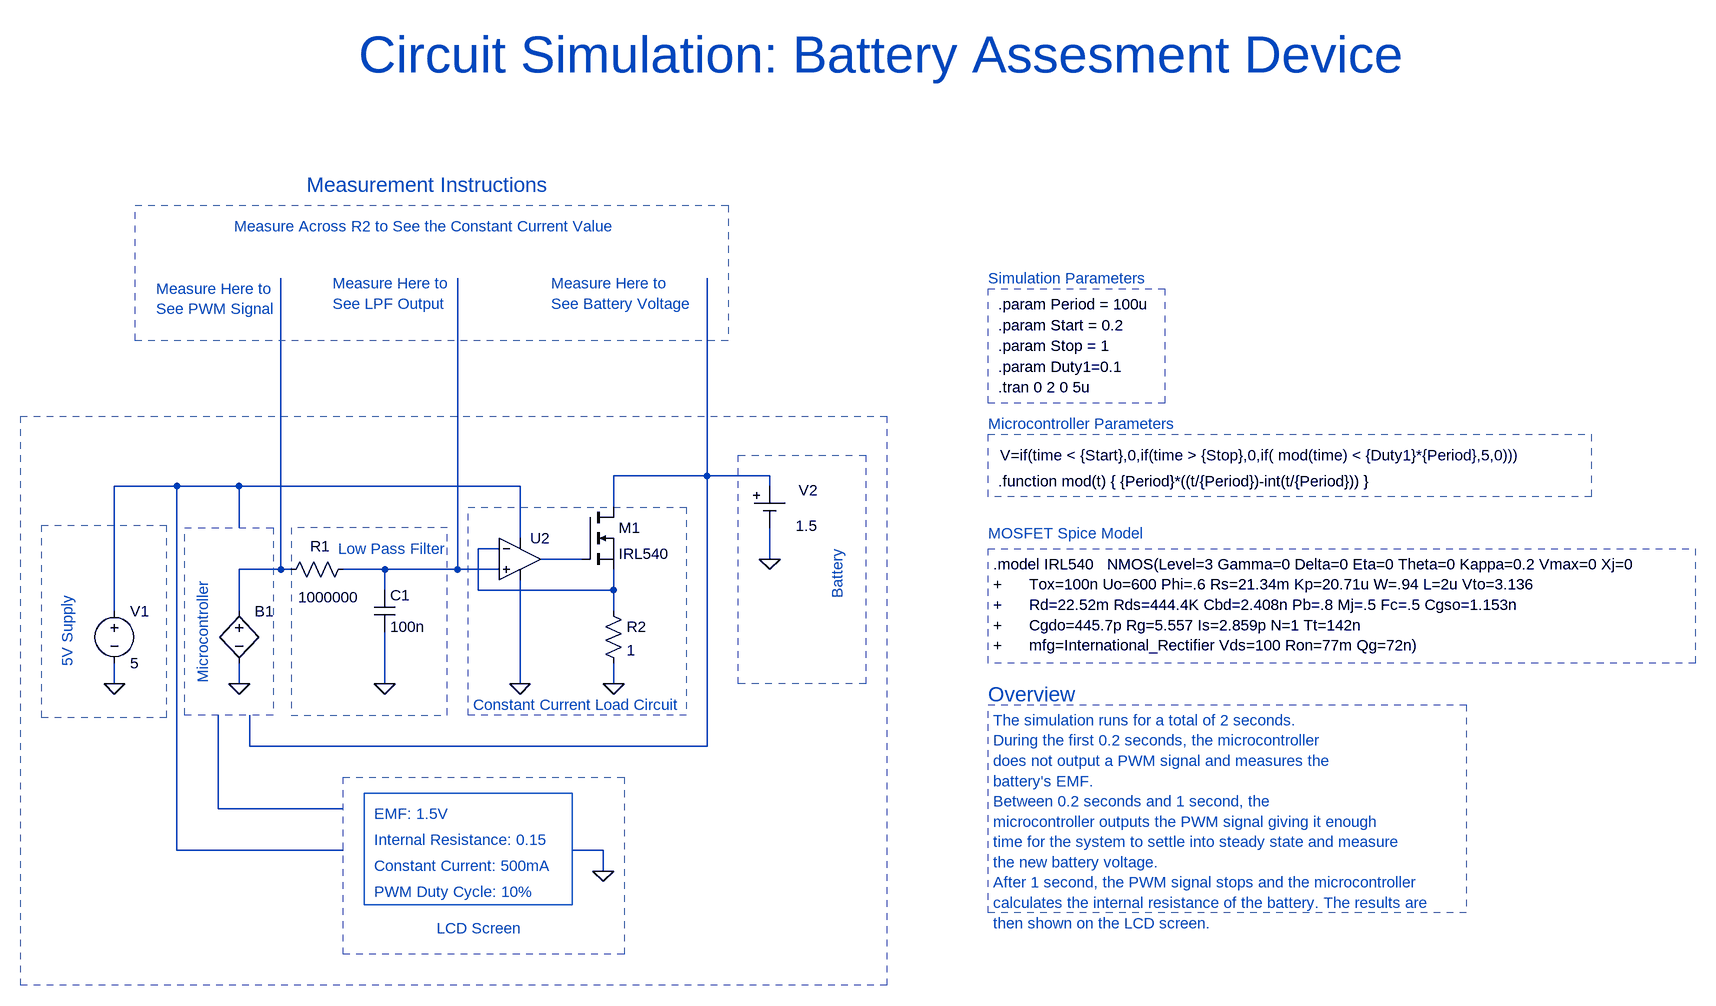
[diagram p0: schematic Design Simulation.asc]
Design Simulation.asc, the LTspice schematic file:
Version 4
SHEET 1 2728 1588
WIRE -176 448 -176 144
WIRE -176 448 -320 448
WIRE -80 448 -176 448
WIRE -992 464 -1088 464
WIRE -896 464 -992 464
WIRE -464 464 -896 464
WIRE -80 464 -80 448
WIRE -320 496 -320 448
WIRE -896 528 -896 464
WIRE -464 544 -464 464
WIRE -496 560 -528 560
WIRE -368 576 -432 576
WIRE -80 576 -80 528
WIRE -832 592 -832 144
WIRE -832 592 -896 592
WIRE -816 592 -832 592
WIRE -672 592 -736 592
WIRE -560 592 -560 144
WIRE -560 592 -672 592
WIRE -496 592 -560 592
WIRE -672 624 -672 592
WIRE -528 624 -528 560
WIRE -320 624 -320 592
WIRE -320 624 -528 624
WIRE -1088 656 -1088 464
WIRE -896 656 -896 592
WIRE -320 656 -320 624
WIRE -1088 768 -1088 736
WIRE -896 768 -896 736
WIRE -672 768 -672 688
WIRE -464 768 -464 608
WIRE -320 768 -320 736
WIRE -880 864 -880 816
WIRE -176 864 -176 448
WIRE -176 864 -880 864
WIRE -928 960 -928 816
WIRE -736 960 -928 960
WIRE -992 1024 -992 464
WIRE -736 1024 -992 1024
WIRE -336 1024 -384 1024
WIRE -336 1056 -336 1024
FLAG -672 768 0
FLAG -896 768 0
FLAG -320 768 0
FLAG -80 576 0
FLAG -464 768 0
FLAG -1088 768 0
FLAG -336 1056 0
SYMBOL res -720 576 R90
WINDOW 0 -4 51 VBottom 2
WINDOW 3 43 38 VTop 2
SYMATTR InstName R1
SYMATTR Value 1000000
SYMBOL cap -688 624 R0
SYMATTR InstName C1
SYMATTR Value 100n
SYMBOL bv -896 640 R0
WINDOW 3 1171 -224 Left 2
SYMATTR Value V=if(time < {Start},0,if(time > {Stop},0,if( mod(time) < {Duty1}*{Period},5,0)))
SYMATTR InstName B1
SYMBOL voltage -1088 640 R0
SYMATTR InstName V1
SYMATTR Value 5
SYMBOL nmos -368 496 R0
SYMATTR InstName M1
SYMATTR Value IRL540
SYMBOL res -336 640 R0
SYMATTR InstName R2
SYMATTR Value 1
SYMBOL Misc/cell -80 464 R0
WINDOW 3 40 61 Left 2
WINDOW 0 45 6 Left 2
SYMATTR Value 1.5
SYMATTR InstName V2
SYMATTR SpiceLine Rser=0.15
SYMBOL Opamps/UniversalOpamp2 -464 576 R0
SYMATTR InstName U2
TEXT 264 584 Left 2 !.model IRL540   NMOS(Level=3 Gamma=0 Delta=0 Eta=0 Theta=0 Kappa=0.2 Vmax=0 Xj=0\n+      Tox=100n Uo=600 Phi=.6 Rs=21.34m Kp=20.71u W=.94 L=2u Vto=3.136\n+      Rd=22.52m Rds=444.4K Cbd=2.408n Pb=.8 Mj=.5 Fc=.5 Cgso=1.153n\n+      Cgdo=445.7p Rg=5.557 Is=2.859p N=1 Tt=142n\n+      mfg=International_Rectifier Vds=100 Ron=77m Qg=72n)
TEXT 272 312 Left 2 !.tran 0 2 0 5u
TEXT 272 456 Left 2 !.function mod(t) { {Period}*((t/{Period})-int(t/{Period})) }
TEXT 272 184 Left 2 !.param Period = 100u
TEXT 272 280 Left 2 !.param Duty1=0.1
TEXT 272 216 Left 2 !.param Start = 0.2
TEXT 256 368 Left 2 ;Microcontroller Parameters
TEXT -952 608 VRight 2 ;Microcontroller
TEXT -744 560 Left 2 ;Low Pass Filter
TEXT 256 144 Left 2 ;Simulation Parameters
TEXT -536 800 Left 2 ;Constant Current Load Circuit
TEXT 256 536 Left 2 ;MOSFET Spice Model
TEXT -1160 632 VRight 2 ;5V Supply
TEXT -688 968 Left 2 ;EMF: 1.5V
TEXT -688 1008 Left 2 ;Internal Resistance: 0.15
TEXT -688 1048 Left 2 ;Constant Current: 500mA
TEXT -688 1088 Left 2 ;PWM Duty Cycle: 10%
TEXT -592 1144 Left 2 ;LCD Screen
TEXT 24 560 VRight 2 ;Battery
TEXT -1024 160 Left 2 ;Measure Here to\nSee PWM Signal
TEXT -752 152 Left 2 ;Measure Here to\nSee LPF Output
TEXT -416 152 Left 2 ;Measure Here to\nSee Battery Voltage
TEXT -904 64 Left 2 ;Measure Across R2 to See the Constant Current Value
TEXT 256 784 Left 3 ;Overview
TEXT -792 0 Left 3 ;Measurement Instructions
TEXT 272 248 Left 2 !.param Stop = 1
TEXT 264 824 Left 2 ;The simulation runs for a total of 2 seconds.\nDuring the first 0.2 seconds, the microcontroller\ndoes not output a PWM signal and measures the \nbattery's EMF.\nBetween 0.2 seconds and 1 second, the \nmicrocontroller outputs the PWM signal giving it enough \ntime for the system to settle into steady state and measure \nthe new battery voltage.\nAfter 1 second, the PWM signal stops and the microcontroller\ncalculates the internal resistance of the battery. The results are\nthen shown on the LCD screen.
TEXT -712 -200 Left 6 ;Circuit Simulation: Battery Assesment Device
RECTANGLE Normal -980 528 -844 816 1
RECTANGLE Normal -576 528 -816 816 1
RECTANGLE Normal -1200 524 -1008 820 1
RECTANGLE Normal -704 936 -384 1108
RECTANGLE Normal -736 912 -304 1184 1
RECTANGLE Normal -544 496 -208 816 1
RECTANGLE Normal -1232 356 100 1232 1
RECTANGLE Normal -128 416 68 768 1
RECTANGLE Normal -1056 32 -144 240 1
RECTANGLE Normal 1344 736 256 560 1
RECTANGLE Normal 528 336 256 160 1
RECTANGLE Normal 1184 480 256 384 1
RECTANGLE Normal 992 1120 256 800 1

The netlist it stands for:
* Design Simulation.asc
R1 N006 N005 1000000
C1 N006 0 100n
B1 N005 0 V=if(time < {Start},0,if(time > {Stop},0,if( mod(time) < {Duty1}*{Period},5,0)))
V1 N002 0 5
M1 N001 N004 N003 N003 IRL540
R2 N003 0 1
V2 N001 0 1.5 Rser=0.15
XU2 N006 N003 N002 0 N004 level.2 Avol=1Meg GBW=10Meg Slew=10Meg ilimit=25m rail=0 Vos=0 phimargin=45 en=0 enk=0 in=0 ink=0 Rin=500Meg  ; pins IN+ IN- V+ V- OUT
.model NMOS NMOS
.model PMOS PMOS
.lib standard.mos
.model IRL540   NMOS(Level=3 Gamma=0 Delta=0 Eta=0 Theta=0 Kappa=0.2 Vmax=0 Xj=0
+      Tox=100n Uo=600 Phi=.6 Rs=21.34m Kp=20.71u W=.94 L=2u Vto=3.136
+      Rd=22.52m Rds=444.4K Cbd=2.408n Pb=.8 Mj=.5 Fc=.5 Cgso=1.153n
+      Cgdo=445.7p Rg=5.557 Is=2.859p N=1 Tt=142n
+      mfg=International_Rectifier Vds=100 Ron=77m Qg=72n)
.tran 0 2 0 5u
.function mod(t) { {Period}*((t/{Period})-int(t/{Period})) }
.param Period = 100u
.param Duty1=0.1
.param Start = 0.2
* Microcontroller Parameters
* Microcontroller
* Low Pass Filter
* Simulation Parameters
* Constant Current Load Circuit
* MOSFET Spice Model
* 5V Supply
* EMF: 1.5V
* Internal Resistance: 0.15
* Constant Current: 500mA
* PWM Duty Cycle: 10%
* LCD Screen
* Battery
* Measure Here to
* See PWM Signal
* Measure Here to
* See LPF Output
* Measure Here to
* See Battery Voltage
* Measure Across R2 to See the Constant Current Value
* Overview
* Measurement Instructions
.param Stop = 1
* The simulation runs for a total of 2 seconds.
* During the first 0.2 seconds, the microcontroller
* does not output a PWM signal and measures the
* battery's EMF.
* Between 0.2 seconds and 1 second, the
* microcontroller outputs the PWM signal giving it enough
* time for the system to settle into steady state and measure
* the new battery voltage.
* After 1 second, the PWM signal stops and the microcontroller
* calculates the internal resistance of the battery. The results are
* then shown on the LCD screen.
* Circuit Simulation: Battery Assesment Device
.lib UniversalOpamps2.sub
.backanno
.end